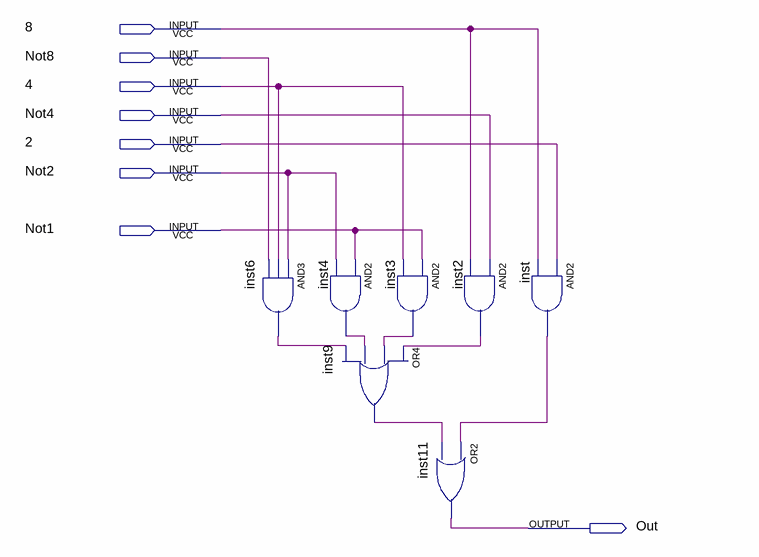
[diagram p0: schematic sheet]
// Quartus schematic F.bdf as structural Verilog: 7 symbols, 8 pins
module F (
  input  \8 ,
  input  Not8,
  input  \4 ,
  input  Not4,
  input  \2 ,
  input  Not2,
  input  Not1,
  output Out
);

  wire inst2_out, inst3_out, inst4_out, inst6_out, inst9_out, inst_out;

  and inst4 (inst4_out, Not1, Not2);
  and inst6 (inst6_out, Not2, \4 , Not8);
  and inst3 (inst3_out, Not1, \4 );
  or inst9 (inst9_out, inst2_out, inst3_out, inst4_out, inst6_out);
  and inst2 (inst2_out, Not4, \8 );
  or inst11 (Out, inst_out, inst9_out);
  and inst (inst_out, \2 , \8 );
endmodule
